# Altium schematic sheet ESP-Grow_OLED_Rev_A.1.SchDoc: ESP-Grow OLED
size A; Date: 04282019; Revision: A; SheetNumber: 1; SheetTotal: 1
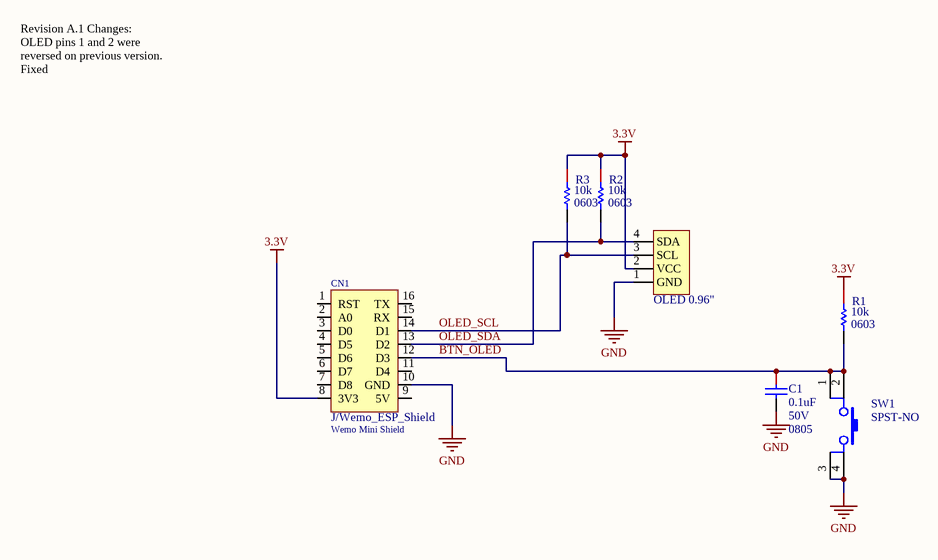
[diagram p0: ESP-Grow_OLED_Rev_A.1.SchDoc]

## Parts
C1  0.1uF  Voltage (Rated): 50V  Package (Imperial): 0805  [CAPC0805(2012)_L]
CN1  J/Wemo_ESP_Shield  Name: Wemo Mini Shield  [Wemos_d1_no3d]
J1  OLED 0.96"  [OLED_0.96_I2C]
R1  Package (Imperial): 0603  [RESC0603(1608)_M]  (hidden comment: 10K)
R2  Package (Imperial): 0603  [RESC0603(1608)_M]  (hidden comment: 10K)
R3  Package (Imperial): 0603  [RESC0603(1608)_M]  (hidden comment: 10K)
SW1  Circuit: SPST-NO  [SW TACT Red 6mm x 6mm]  (hidden comment: PTS645SM43SMTR92 LFS)

## Nets
3.3V: CN1.8(3V3) J1.2(VCC) R1.1 R2.1 R3.1
GND: C1.2 CN1.10(GND) J1.1(GND) SW1.3 SW1.4
BTN_OLED: C1.1 CN1.12(D3) R1.2 SW1.1 SW1.2
OLED_SCL: CN1.14(D1) J1.3(SCL) R3.2
OLED_SDA: CN1.13(D2) J1.4(SDA) R2.2

Not connected (* = marked no-connect by the designer): CN1 1(RST) 2(A0) 3(D0) 4(D5) 5(D6) 6(D7) 7(D8) 9(5V) 11(D4) 15(RX) 16(TX)

## Notes on the sheet
- Revision A.1 Changes:
  OLED pins 1 and 2 were reversed on previous version. Fixed

## Library data of the parts
C1 = CMP-007-0047-08: CAP CER 0.1UF 50V 10% X7R 0805; Capacitance: 100nF; Temperature (Max): 150°C; Dielectric Material: Ceramic; Temperature Coefficient: X8R; Temperature (Min): -55°C; Package (Metric): 2012; Mounting Type: SMD; Tolerance: 10%; Length: 2mm; Height: 1.4mm; Width: 1.25mm
CN1 = J/Wemo_ESP_Shield: Wemo Mini Shield for ESP-12
J1 = OLED_0.96_I2C: SSD1306 I2C OLED 0.96"
R1-R3 = CMP-007-0359-12: RES 10K OHM 1/10W 1% 0603 SMD; Package (Metric): 1608; Power: 100mW; Temperature Coefficient: ±100ppm/°C; Height: 550µm; Resistance: 10k; Termination: SMD/SMT; Tolerance: 1%
SW1 = PTS645SM43SMTR92 LFS: SWITCH TACTILE SPST-NO 0.05A 12V; Manufacturer: C&K; Actuator Type: Standard; Mechanical Life: 100,000 Cycles; Operating Force: 160gf; Outline: 6.00mm x 6.00mm; Illumination: Non-Illuminated; Actuator Material: Polyamide (PA66), Nylon 6/6; Actuator Orientation: Top Actuated; Contact Rating @ Voltage: 0.05A @ 12VDC; Actuator Height off PCB, Vertical: 4.30mm; Switch Function: Off-Mom; Illumination Type, Color: -; ClassName: *; Switch Travel: -; ComponentLink1URL: http://www.ckswitches.com/media/1471/pts645.pdf; ComponentLink1Description: http://www.ckswitches.com/media/1471/pts645.pdf; Part Status: Active; Packaging: Cut Tape (CT); Pricing 1: 1=0.15, 10=0.147, 25=0.1416, 50=0.1366, 100=0.129, 250=0.12144, 500=0.11638 (USD); RoHS: RoHS Compliant; Actuator Length, Right Angle: -; Features: Blue Actuator; Stock 1: 234699; Component Name: PTS645SM43SMTR92 LFS; Ingress Protection: -; Termination Style: Gull Wing; Designator: PTS645SM43SMTR92 LFS; Illumination Voltage (Nominal): -; Operating Temperature: -20°C ~ 60°C; Manufacturer Part Number: PTS645SM43SMTR92 LFS; Mounting Type: Surface Mount; Pin Count: 4